# EAGLE board SparkFun_Pro_Micro_v13a (EAGLE 6.5.0)
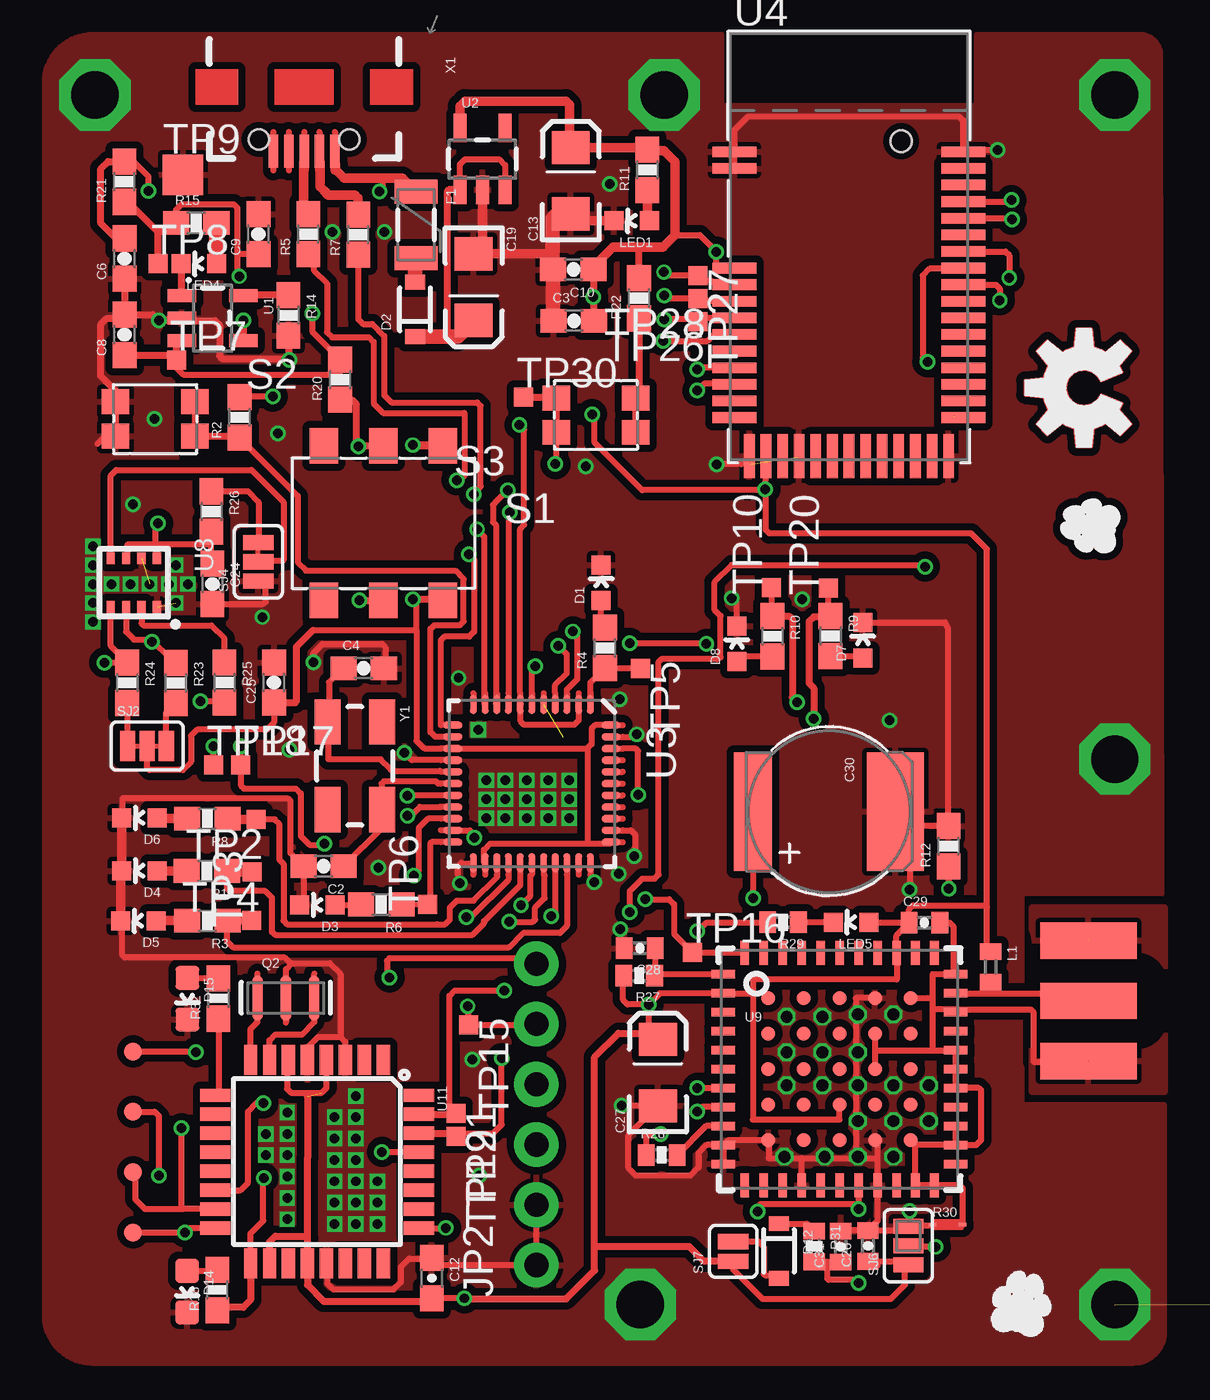
[diagram p5: board, top side]
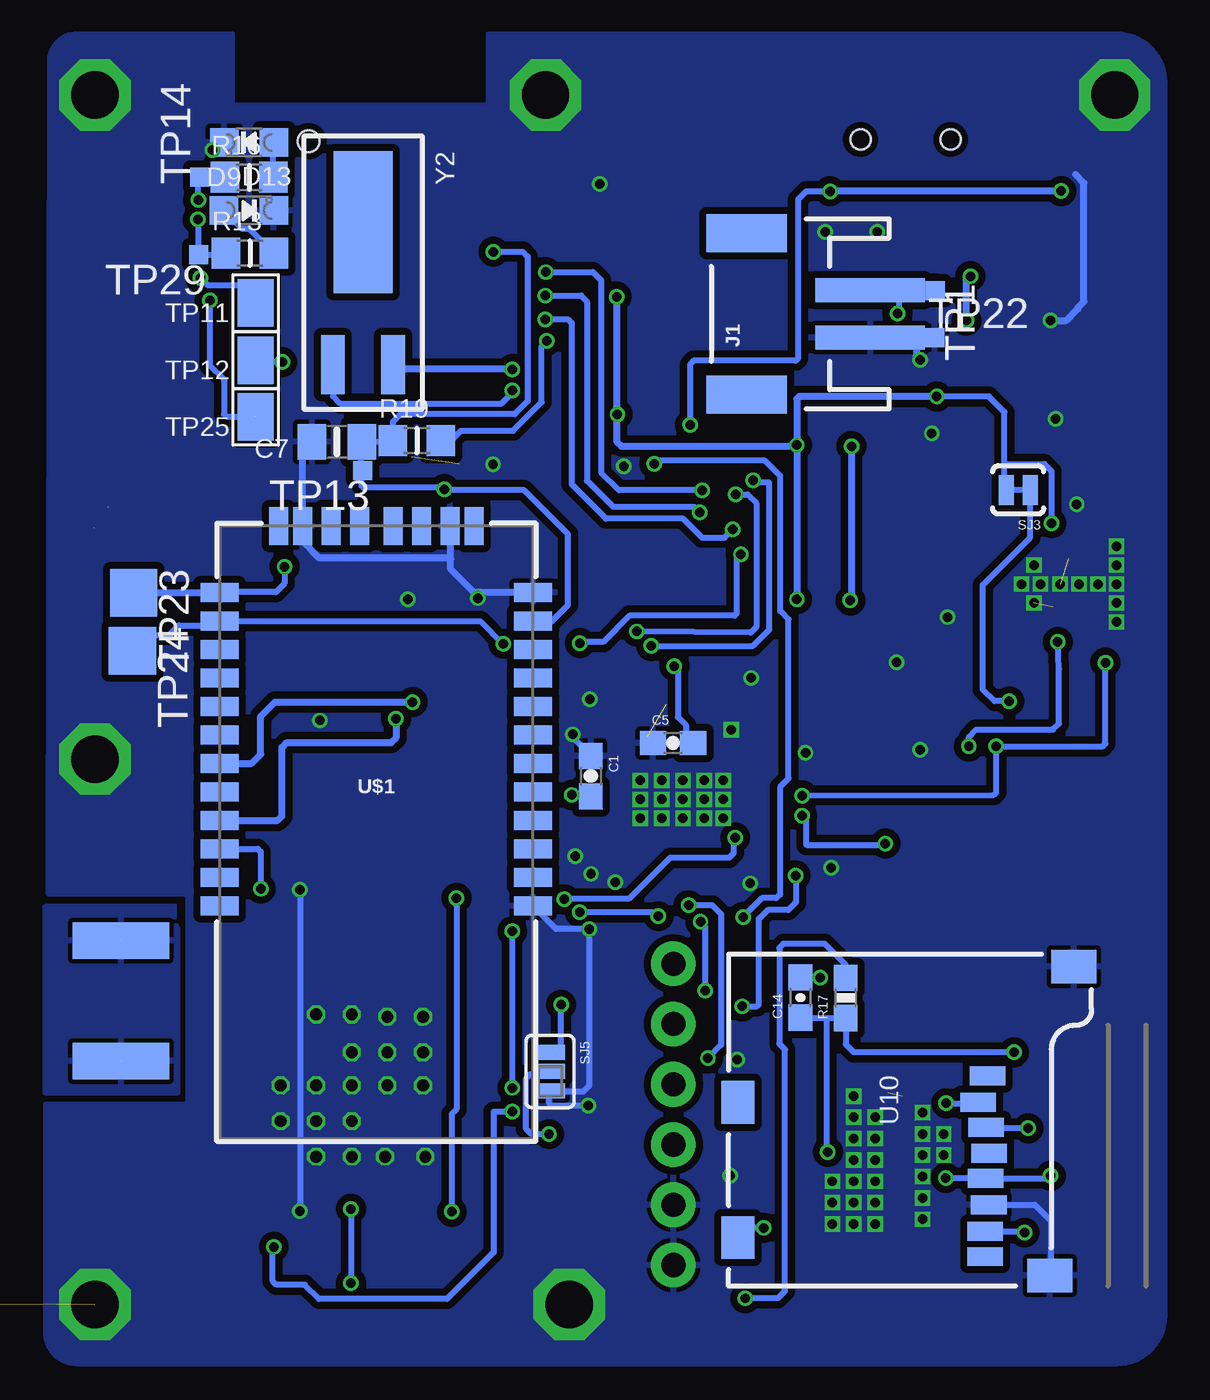
[diagram p6: board, bottom side, seen from below]

No outline drawn. Coordinates in mm, seen from the top.
Copper layers (1*16): Top 0.018mm / dielectric 1.55mm / Bottom 0.018mm
Design rules "eC_2Layer_PClass6_BaseCopperO18_eCDefault": minimum track width 0.15mm, minimum drill 0.35mm, track to track 0.15mm, track to pad 0.15mm, pad to pad 0.15mm, via to via 0.15mm, smd to smd 0mil, copper to edge 0.25mm, drill to drill 0.35mm, minimum pad ring 0.175mm, minimum via ring 0.125mm, stop-mask expansion 0mil, vias tented up to drill 0.45mm, thermal gap 0.2mm
Net classes: 0 default: width 0.203 mm

## Footprints (pad centres in the part's own frame; a part is rotated, then mirrored left to right if it is on the bottom)
0603-CAP = smd 1.1 x 1: 1 -0.85,0; 2 0.85,0
0805_10MGAP = smd 1.2 x 1.5: 1 -1.05,0; 2 1.05,0
EIA3216 = smd 1.4 x 1.6: A 1.4,0; C -1.4,0
0603-CAP@2 = smd 1.1 x 1: 1 -0.85,0; 2 0.85,0
0402-CAP = smd 0.7 x 0.9: 1 -0.65,0; 2 0.65,0
EN_J2 = smd 5 x 1.6: + 0,-3.2 | smd 5 x 2.4: - 0,2.8
LED-0603 = smd 0.8 x 0.8: A 0,-0.75; C 0,0.75
SOD-323 = smd 0.63 x 0.83: 1 -1.15,0; 2 1.15,0
CHIPLED_0805_NOOUTLINE = smd 1.2 x 1.2: A 0,-1.05; C 0,1.05
LED-0603' = smd 1 x 1: A 0,-0.877; C 0,0.877
PTC-1206 = smd 1 x 1.8: 1 -1.4,0; 2 1.4,0
JST-2-SMD = smd 1 x 4.6: 1 -1,-3.7; 2 1,-3.7 | smd 1.6 x 3.4: NC1 -3.4,1.5; NC2 3.4,1.5
1X06_NO_SILK = drill 1.016 pad 1.88: 1 0,0; 2 2.54,0; 3 5.08,0; 4 7.62,0; 5 10.16,0; 6 12.7,0
SMA-EDGE = smd 1.524 x 4.064: GND@0 0,0; GND@1 5.08,0; SIG 2.54,0 | smd 1.524 x 4.064 bottom: GND@2 0,0; GND@3 5.08,0
C0402 = smd 0.7 x 0.9: 1 -0.65,0; 2 0.65,0
RESONATOR-SMD = smd 0.45 x 1.905: 1 -1.2,0; 2 0,0; 3 1.2,0
0603-RES = smd 1.1 x 1: 1 -0.85,0; 2 0.85,0
_0805MP = smd 1.2 x 1.3: 1 -1.016,0; 2 1.016,0
0603-RES@2 = smd 1.1 x 1: 1 -0.85,0; 2 0.85,0
0402-RES = smd 0.7 x 0.9: 1 -0.65,0; 2 0.65,0
GND-JUMP = smd 0.305 x 0.152: 1 -0.635,0; 2 0.635,0
452403012014 = smd 1.2 x 1.5: 1 -2.5,3.25; 2 0,3.25; 3 2.5,3.25; 4 -2.5,-3.25; 5 0,-3.25; 6 2.5,-3.25
434153017835 = smd 1.15 x 1.05: 1 -1.675,0.725; 2 -1.675,-0.725; 3 1.675,-0.725; 4 1.675,0.725
PAD-JUMPER-3-3OF3_NC_BY_TRACE_YES_SILK_FULL_BOX = smd 0.635 x 1.27: 1 -0.813,0; 2 0,0; 3 0.813,0
PAD-JUMPER-2-NC_BY_TRACE_YES_SILK = smd 0.635 x 1.27: 1 -0.508,0; 2 0.508,0
PAD-JUMPER-3-2OF3_NC_BY_TRACE_YES_SILK_FULL_BOX = smd 0.635 x 1.27: 1 -0.813,0; 2 0,0; 3 0.813,0
SJ_3_PASTE2&3 = smd 0.635 x 1.27: 1 -0.813,0; 2 0,0; 3 0.813,0
SJ_2S = smd 0.635 x 1.27: 1 -0.412,0; 2 0.412,0
TP08SQ = smd 0.8 x 0.8: TP 0,0
TP17SQ = smd 1.7 x 1.7: TP 0,0
PAD-1.5X2.0 = smd 1.5 x 2: P$1 0,0
TP20SQ = smd 2 x 2: TP 0,0
PAD.03X.03 = smd 0.762 x 0.762: P$1 0,0
SOT23-5 = smd 0.55 x 1.2: 1 -0.95,-1.3; 2 0,-1.3; 3 0.95,-1.3; 4 0.95,1.3; 5 -0.95,1.3
QFN-44-NOPAD_1:1-OUTFAKES = smd 0.8 x 0.3: 1 -3.337,2.465; 2 -3.337,1.972; 3 -3.337,1.479; 4 -3.337,0.986; 5 -3.337,0.493; 6 -3.337,0; 7 -3.337,-0.493; 8 -3.337,-0.986; 9 -3.337,-1.479; 10 -3.337,-1.972; 11 -3.337,-2.465; 23 3.337,-2.465; 24 3.337,-1.972; 25 3.337,-1.479; 26 3.337,-0.986; 27 3.337,-0.493; 28 3.337,0; 29 3.337,0.493; 30 3.337,0.986; 31 3.337,1.479; 32 3.337,1.972; 33 3.337,2.465 | smd 0.3 x 0.8: 12 -2.465,-3.337; 13 -1.972,-3.337; 14 -1.479,-3.337; 15 -0.986,-3.337; 16 -0.493,-3.337; 17 0,-3.337; 18 0.493,-3.337; 19 0.986,-3.337; 20 1.479,-3.337; 21 1.972,-3.337; 22 2.465,-3.337; 34 2.465,3.337; 35 1.972,3.337; 36 1.479,3.337; 37 0.986,3.337; 38 0.493,3.337; 39 0,3.337; 40 -0.493,3.337; 41 -0.986,3.337; 42 -1.479,3.337; 43 -1.972,3.337; 44 -2.465,3.337
BLE_MODULE_RAYTAC_MDBT40 = smd 1.85 x 0.45: 1 -4.825,4; 2 -4.825,3.3; 3 -4.825,-0.9; 4 -4.825,-1.6; 5 -4.825,-2.3; 6 -4.825,-3; 7 -4.825,-3.7; 8 -4.825,-4.4; 9 -4.825,-5.1; 10 -4.825,-5.8; 11 -4.825,-6.5; 12 -4.825,-7.2; 26 4.825,-7.2; 27 4.825,-6.5; 28 4.825,-5.8; 29 4.825,-5.1; 30 4.825,-4.4; 31 4.825,-3.7; 32 4.825,-3; 33 4.825,-2.3; 34 4.825,-1.6; 35 4.825,-0.9; 36 4.825,-0.2; 37 4.825,0.5; 38 4.825,1.2; 39 4.825,1.9; 40 4.825,2.6; 41 4.825,3.3; 42 4.825,4 | smd 0.45 x 1.85: 13 -4.2,-8.825; 14 -3.5,-8.825; 15 -2.8,-8.825; 16 -2.1,-8.825; 17 -1.4,-8.825; 18 -0.7,-8.825; 19 0,-8.825; 20 0.7,-8.825; 21 1.4,-8.825; 22 2.1,-8.825; 23 2.8,-8.825; 24 3.5,-8.825; 25 4.2,-8.825 | hole 0.9: 2.2,4.45
BME280_LGA = smd 0.5 x 0.35: P$1 1.025,0.975; P$2 1.025,0.325; P$3 1.025,-0.325; P$4 1.025,-0.975; P$5 -1.025,-0.975; P$6 -1.025,-0.325; P$7 -1.025,0.325; P$8 -1.025,0.975
VENUS638FLPX = smd 1 x 0.36: 1 -4.9,4; 2 -4.9,3.2; 3 -4.9,2.4; 4 -4.9,1.6; 5 -4.9,0.8; 6 -4.9,0; 7 -4.9,-0.8; 8 -4.9,-1.6; 9 -4.9,-2.4; 10 -4.9,-3.2; 11 -4.9,-4; 23 4.9,-4; 24 4.9,-3.2; 25 4.9,-2.4; 26 4.9,-1.6; 27 4.9,-0.8; 28 4.9,0; 29 4.9,0.8; 30 4.9,1.6; 31 4.9,2.4; 32 4.9,3.2; 33 4.9,4 | smd 0.36 x 1: 12 -4,-4.9; 13 -3.2,-4.9; 14 -2.4,-4.9; 15 -1.6,-4.9; 16 -0.8,-4.9; 17 0,-4.9; 18 0.8,-4.9; 19 1.6,-4.9; 20 2.4,-4.9; 21 3.2,-4.9; 22 4,-4.9; 34 4,4.9; 35 3.2,4.9; 36 2.4,4.9; 37 1.6,4.9; 38 0.8,4.9; 39 0,4.9; 40 -0.8,4.9; 41 -1.6,4.9; 42 -2.4,4.9; 43 -3.2,4.9; 44 -4,4.9 | smd 0.6 x 0.6: 45 -3,3; 46 -3,1.5; 47 -3,0; 48 -3,-1.5; 49 -3,-3; 50 -1.5,3; 51 -1.5,1.5; 52 -1.5,0; 53 -1.5,-1.5; 54 -1.5,-3; 55 0,3; 56 0,1.5; 57 0,0; 58 0,-1.5; 59 0,-3; 60 1.5,3; 61 1.5,1.5; 62 1.5,0; 63 1.5,-1.5; 64 1.5,-3; 65 3,3; 66 3,1.5; 67 3,0; 68 3,-1.5; 69 3,-3
MICROSD_1:1 = smd 0.8 x 1.5: 1 5.096,10.919; 2 6.218,10.519; 3 7.274,10.853; 4 8.367,10.982; 5 9.421,10.828; 6 10.539,10.973; 7 11.648,10.819; 8 12.721,10.819 | smd 1.8 x 1.4: CD1 11.92,0.4; CD2 6.22,0.4 | smd 1.4 x 1.9: GND1 0.497,14.55; GND3 13.52,13.55
TQFP32-08 = smd 1.27 x 0.559: 1 -4.293,2.8; 2 -4.293,2; 3 -4.293,1.2; 4 -4.293,0.4; 5 -4.293,-0.4; 6 -4.293,-1.2; 7 -4.293,-2; 8 -4.293,-2.8; 17 4.293,-2.8; 18 4.293,-2; 19 4.293,-1.2; 20 4.293,-0.4; 21 4.293,0.4; 22 4.293,1.2; 23 4.293,2; 24 4.293,2.8 | smd 0.559 x 1.27: 9 -2.8,-4.293; 10 -2,-4.293; 11 -1.2,-4.293; 12 -0.4,-4.293; 13 0.4,-4.293; 14 1.2,-4.293; 15 2,-4.293; 16 2.8,-4.293; 25 2.8,4.293; 26 2,4.293; 27 1.2,4.293; 28 0.4,4.293; 29 -0.4,4.293; 30 -1.2,4.293; 31 -2,4.293; 32 -2.8,4.293
RN41 = smd 0.8 x 1.6: 1 -6.6,-6.6; 2 -5.4,-6.6; 3 -4.2,-6.6; 4 -3,-6.6; 5 -1.8,-6.6; 6 -0.6,-6.6; 7 0.6,-6.6; 8 1.8,-6.6; 9 3,-6.6; 10 4.2,-6.6; 11 5.4,-6.6; 12 6.6,-6.6; 13 6.6,6.6; 14 5.4,6.6; 15 4.2,6.6; 16 3,6.6; 17 1.8,6.6; 18 0.6,6.6; 19 -0.6,6.6; 20 -1.8,6.6; 21 -3,6.6; 22 -4.2,6.6; 23 -5.4,6.6; 24 -6.6,6.6 | smd 1.6 x 0.8: 28 9.4,3.1; 29 9.4,-3.1; 30 9.4,4.122; 31 9.4,1.9; 32 9.4,0.7; 33 9.4,-0.7; 34 9.4,-1.9; 35 9.4,-4.122
USB-AB-MICRO-SMD-V03-IN&OUT = smd 1.4 x 0.4: D+1 2.7,0; D-1 2.7,0.65; GND1 2.7,-1.3; ID1 2.7,-0.65; VBUS1 2.7,1.3 | hole 0.85: 2.2,1.9; 2.2,-1.9
CRYSTAL-SMD-5X3 = smd 1.9 x 1.1: 1 -1.85,-1.15; 2 1.85,-1.15; 3 1.85,1.15; 4 -1.85,1.15
CRYSTAL_CYL_2X6MM_SMT = smd 2.5 x 1: 1 2.125,1.27; 2 2.125,-1.27 | smd 6 x 2.5: CYLINDER -3.875,0

## Placement (x,y rotation side)
C1  0.1uF  [0603-CAP]  27.03,22.84 270 bottom
C2  22pF  [0603-CAP]  14.58,19.05 180 top
C3  0.1uF  [0603-CAP]  25.13,42.04 0 top
C4  22pF  [0603-CAP]  16.27,27.39 0 top
C5  1uF  [0603-CAP]  23.56,24.24 0 bottom
C6  1uF  [0603-CAP]  6.19,44.66 90 top
C7  1uF  [0805_10MGAP]  37.73,36.94 180 bottom
C8  4.7uF  [0603-CAP]  6.19,41.45 90 top
C9  4.7uF  [0603-CAP]  11.84,45.69 90 top
C10  1uF  [0603-CAP]  25.11,44.2 180 top
C12  0.1uF  [0603-CAP]  19.14,1.68 270 top
C13  10uF  [EIA3216]  25,47.94 90 top
C14  0.1uF  [0603-CAP]  18.19,13.51 90 bottom
C19  10uF  [EIA3216]  20.91,43.46 270 top
C24  0.1uF  [0603-CAP@2]  9.89,30.95 270 top
C25  0.1uF  [0603-CAP@2]  12.49,26.79 90 top
C26  0.1uF  [0402-CAP]  37.53,3.04 90 top
C27  10uF  [EIA3216]  28.67,10.34 90 top
C28  1uF  [0402-CAP]  27.91,15.59 180 top
C29  22pF  [0402-CAP]  39.91,16.66 0 top
C30  DNP  [EN_J2]  35.89,21.35 270 top
C31  0.1uF  [0402-CAP]  36.38,3.01 90 top
D1  Yellow  [LED-0603]  26.28,31 0 top
D2  [SOD-323]  18.44,42.52 90 top
D3  Green  [LED-0603]  14.32,17.41 90 top
D4  Yellow  [LED-0603]  6.82,18.85 90 top
D5  Yellow  [LED-0603]  6.77,16.74 90 top
D6  Yellow  [LED-0603]  6.82,21.08 90 top
D7  Yellow  [LED-0603]  37.31,28.57 0 top
D8  Yellow  [LED-0603]  32,28.42 0 top
D9  RED  [CHIPLED_0805_NOOUTLINE]  41.44,46.69 270 bottom
D12  BAS16  [SOD-323]  33.78,2.83 270 top
D13  BLUE  [CHIPLED_0805_NOOUTLINE]  41.43,49.56 90 bottom
D14  GREEN  [LED-0603']  8.83,1.11 180 top
D15  BLUE  [LED-0603']  8.84,13.46 180 top
F1  500mA  [PTC-1206]  18.48,46.08 270 top
J1  [JST-2-SMD]  18.95,42.33 90 bottom
JP2  [1X06_NO_SILK]  23.55,2.23 90 top
JP10  SMA_EDGE  [SMA-EDGE]  46.83,10.83 90 top
L1  33nH  [C0402]  42.7,14.8 270 top
LED1  Red  [LED-0603]  27.57,46.25 90 top
LED4  Red  [LED-0603]  9.32,44.44 90 top
LED5  Red  [LED-0603]  36.82,16.68 90 top
Q2  16MHZ  [RESONATOR-SMD]  12.99,13.49 0 top
R1  330  [0603-RES]  9.66,18.85 180 top
R2  10K  [0603-RES]  11.04,37.97 90 top
R3  330  [0603-RES]  9.68,16.75 180 top
R4  330  [0603-RES]  26.44,28.25 90 top
R5  22  [0603-RES]  13.94,45.69 90 top
R6  330  [0603-RES]  17.01,17.43 180 top
R7  22  [0603-RES]  16.04,45.67 90 top
R8  330  [0603-RES]  9.68,21.05 180 top
R9  330  [0603-RES]  35.95,28.75 270 top
R10  330  [0603-RES]  33.5,28.74 270 top
R11  1K  [0603-RES]  28.23,48.4 90 top
R12  10K  [0603-RES]  40.93,19.89 90 top
R13  2K  [_0805MP]  41.4,44.89 0 bottom
R14  2K  [0603-RES]  13.1,42.27 270 top
R15  330  [0603-RES]  9.21,46.16 0 top
R16  2K  [_0805MP]  41.43,48.09 0 bottom
R17  10K  [0603-RES]  16.28,13.49 90 bottom
R18  330  [0603-RES]  10.1,1.18 90 top
R19  100K  [_0805MP]  34.36,36.99 0 bottom
R20  1  [0603-RES]  15.28,39.56 90 top
R21  1  [0603-RES]  6.18,47.9 90 top
R22  10K  [0603-RES]  27.88,42.99 90 top
R23  4.7K  [0603-RES@2]  8.35,26.77 270 top
R24  4.7K  [0603-RES@2]  6.3,26.78 270 top
R25  4.7K  [0603-RES@2]  10.4,26.79 270 top
R26  4.7K  [0603-RES@2]  9.85,34 270 top
R27  33k  [0402-RES]  27.88,14.43 180 top
R28  10k  [0402-RES]  28.84,6.87 0 top
R29  330  [0402-RES]  33.95,16.68 180 top
R30  0  [GND-JUMP]  40.89,3.94 0 top
R31  330  [0402-RES]  35.26,3.02 270 top
R32  1K  [0603-RES]  10.15,13.47 90 top
S1  [452403012014]  17.1,33.51 0 top
S2  [434153017835]  7.48,37.9 0 top
S3  [434153017835]  26.06,38.06 180 top
SJ2  EN I2C PULL  [PAD-JUMPER-3-3OF3_NC_BY_TRACE_YES_SILK_FULL_BOX]  7.14,24.11 0 top
SJ3  EN I2C MODE  [PAD-JUMPER-2-NC_BY_TRACE_YES_SILK]  9.01,34.91 180 bottom
SJ4  EN ADR PULLUP  [PAD-JUMPER-3-2OF3_NC_BY_TRACE_YES_SILK_FULL_BOX]  11.83,31.88 90 top
SJ5  BTS  [SJ_3_PASTE2&3]  28.75,10.39 270 bottom
SJ6  PSE  [SJ_3_PASTE2&3]  39.23,3.05 90 top
SJ7  BAT  [SJ_2S]  31.85,2.81 90 top
TP1  TPTP08SQ  [TP08SQ]  12.51,43.31 270 bottom
TP2  TPTP08SQ  [TP08SQ]  11.73,21.02 180 top
TP3  TPTP08SQ  [TP08SQ]  11.55,16.76 90 top
TP4  TPTP08SQ  [TP08SQ]  11.57,18.8 180 top
TP5  TPTP08SQ  [TP08SQ]  27.93,27.39 270 top
TP6  TPTP08SQ  [TP08SQ]  18.97,17.43 90 top
TP7  TPTP08SQ  [TP08SQ]  8.39,40.39 0 top
TP8  TPTP08SQ  [TP08SQ]  7.61,44.44 0 top
TP9  TPTP17SQ  [TP17SQ]  8.65,48.19 0 top
TP10  TPTP08SQ  [TP08SQ]  33.47,30.8 90 top
TP11  SWCLK  [PAD-1.5X2.0]  41.16,42.79 180 bottom
TP12  SWDIO  [PAD-1.5X2.0]  41.16,40.38 180 bottom
TP13  TPTP08SQ  [TP08SQ]  36.64,35.73 180 bottom
TP14  TPTP08SQ  [TP08SQ]  43.51,48.1 90 bottom
TP15  TPTP08SQ  [TP08SQ]  20.7,12.35 270 top
TP16  TPTP08SQ  [TP08SQ]  30.14,15.42 0 top
TP17  TPTP08SQ  [TP08SQ]  11.09,23.32 0 top
TP18  TPTP08SQ  [TP08SQ]  9.94,23.32 0 top
TP19  TPTP08SQ  [TP08SQ]  20.16,7.65 270 top
TP20  TPTP08SQ  [TP08SQ]  35.86,30.77 90 top
TP21  TPTP08SQ  [TP08SQ]  20.17,8.63 270 top
TP22  TPTP08SQ  [TP08SQ]  12.52,41.33 0 bottom
TP23  TPTP20SQ  [TP20SQ]  46.3,30.58 270 bottom
TP24  TPTP20SQ  [TP20SQ]  46.35,28.13 270 bottom
TP25  FCTRST  [PAD-1.5X2.0]  41.16,37.99 180 bottom
TP26  TPTP08SQ  [TP08SQ]  30.36,42.01 180 top
TP27  TPTP08SQ  [TP08SQ]  30.37,43.95 270 top
TP28  TPTP08SQ  [TP08SQ]  30.37,42.97 180 top
TP29  TPTP08SQ  [TP08SQ]  43.56,44.82 180 bottom
TP30  TPTP08SQ  [TP08SQ]  23.01,38.83 0 top
TP32  TEST-POINT3  [PAD.03X.03]  6.55,3.61 270 top
TP33  TEST-POINT3  [PAD.03X.03]  6.55,6.15 0 top
TP34  TEST-POINT3  [PAD.03X.03]  6.55,8.69 270 top
TP35  TEST-POINT3  [PAD.03X.03]  6.55,11.23 270 top
U1  MCP73831  [SOT23-5]  9.9,42.15 270 top
U2  MIC5219  [SOT23-5]  21.28,48.86 0 top
U3  ATMEGA32U4  [QFN-44-NOPAD_1:1-OUTFAKES]  23.36,22.53 270 top
U4  32KB NRF51822  [BLE_MODULE_RAYTAC_MDBT40]  36.73,45.16 0 top
U8  BME280  [BME280_LGA]  6.58,31 270 top
U9  VENUS638FLPX-L  [VENUS638FLPX]  36.33,10.49 0 top
U10  microSD Socket  [MICROSD_1:1]  21.22,15.31 270 bottom
U11  ATMEGA328P_TQFP  [TQFP32-08]  14.3,6.59 270 top
U$1  BLUETOOTH-RN-41"  [RN41]  36.07,23.98 90 bottom
U$3  [OSHW-LOGO-M_COPPER]  46.63,39.21 90 top
U$4  [OSHW-LOGO-M]  46.63,39.21 90 top
X1  [USB-AB-MICRO-SMD-V03-IN&OUT]  13.76,51.89 270 top
Y1  16MHz  [CRYSTAL-SMD-5X3]  15.89,23.28 270 top
Y2  32.768kHz (535-9166-2-ND)  [CRYSTAL_CYL_2X6MM_SMT]  36.63,42.32 270 bottom

## Tracks (layer width: path | path; a pad name or v marks a point on that pad's centre or on a via)
!CS
  Top 0.254: 6.84,29.9 6.86,29.87 U8.P$2 6.9,29.28 6.99,29.2 9.84,29.2 10.4,28.64 R25.1
ANT
  Top 0.254: 46.54,13.66 JP10.SIG 46.51,13.69 42.69,13.69 | U9.32 42.69,13.69 | L1.2 42.7,13.7 42.69,13.69
AREF  (via drill 0.4 pad 0.25)
  Top 0.254: v27.84,22.05 27.84,23.9 27.74,24 27.19,24 27.19,24.01
  Bottom 0.254: C1.2 27.73,21.99 27.79,22.05 v27.84,22.05
BOOT_SEL
  Top 0.254: U9.9 30.71,8.09 R28.2
CD  (via drill 0.4 pad 0.25)
  Top 0.254: U11.25 19.73,3.79 v19.74,3.8
  Bottom 0.254: v19.74,3.8 20.41,3.8 U10.CD1
CONNECTED  (via drill 0.4 pad 0.25)
  Top 0.254: U4.39 43.51,47.06 v43.58,47.13
  Bottom 0.254: R16.1 42.45,48.1 TP14.TP 43.54,48.07 | 43.75,47.86 43.54,48.07 | 43.54,48.07 43.54,47.95 43.6,47.89 43.6,47.15 v43.58,47.13
CS  (via drill 0.4 pad 0.25)
  Top 0.254: U11.14 11.08,5.39 11.39,5.7 11.39,8.7 11.74,9.05 v12.04,9.05
  Bottom 0.254: v12.04,9.05 10.74,9.05 U10.2
CS_3V  (via drill 0.4 pad 0.25)
  Top 0.254: 31.86,41.5 U4.7 31.88,41.48 31.05,41.48 30.76,41.19 v28.89,41.19
  Bottom 0.254: R19.2 33.28,36.99 | 33.28,36.99 33.24,36.95 | 33.28,36.99 32.91,36.99 32.5,37.4 30.3,37.4 29.1,38.6 29.1,40.98 v28.89,41.19
D1  (via drill 0.4)
  Top 0.254: 35.79,30.84 TP20.TP 35.86,29.62 R9.1
  Top 0.305: R9.1 35.95,29.57 35.94,29.56 35.24,29.56 35.04,29.36 35.04,26.76 35.24,26.56 v35.24,25.26
  Bottom 0.305: U$1.21 40.22,20.98 40.04,21.16 40.04,24.06 39.84,24.26 35.44,24.26 35.24,24.46 v35.24,25.26
D2  (via drill 0.4)
  Top 0.254: TP10.TP 33.47,29.62 R10.1
  Top 0.305: R10.1 34.21,29.59 34.34,29.46 34.34,26.16 v34.54,25.96
  Bottom 0.305: U$1.19 41.32,23.38 40.94,23.76 40.94,25.36 40.34,25.96 v34.54,25.96
D4
  Top 0.254: 11.94,20.92 11.84,21.02 TP2.TP 12.52,21.02 12.72,20.82 12.72,19.32 12.89,19.15 12.89,16.75 13.04,16.6 19.36,16.6 19.7,16.6 19.9,16.8 19.9,17.3 20.2,17.6 20.9,17.6 21.88,18.58 21.88,18.7
  Top 0.406: TP2.TP 10.56,21.02 R8.1
D5
  Top 0.254: 24.84,18.7 24.84,16.53 24.54,16.23 22.99,16.23 22.39,15.63 10.76,15.63 10.52,15.87 10.52,16.74 R3.1
  Top 0.406: TP3.TP 10.56,16.78 R3.1
D6
  Top 0.254: R1.1 10.52,18.84 10.52,18.09 10.61,18 12.12,18 12.41,17.71 12.41,16.27 12.53,16.15 20.85,16.15 21.34,16.64 21.34,16.72 22.86,18.24 22.86,18.7
  Top 0.406: TP4.TP 10.55,18.81 R1.1
D14
  Top 0.254: U3.1 25.82,26.34 25.84,26.35 | 25.82,26.34 25.82,26.79 R4.1 27.87,27.4 TP5.TP
D+  (via drill 0.4 pad 0.25)
  Top 0.254: v20.19,35.32 20.34,35.32 20.54,35.52 20.54,38.12 20.51,38.15 17.09,38.15 16.69,38.55 16.69,41.15 16.49,41.35 16.48,41.34 14.93,41.34 14.72,41.55 14.72,43.62 14.19,44.15 14.19,44.59 R5.1 | 24.34,26.34 24.34,26.69 24.83,27.18 24.83,27.98 v24.48,28.33
  Bottom 0.254: v20.19,35.32 20.08,35.21 19.5,35.21 19.5,29.01 20.18,28.33 v24.48,28.33
D-  (via drill 0.4 pad 0.25)
  Top 0.254: R7.1 16.04,42.1 16.24,41.9 16.64,41.9 17.14,41.4 17.14,38.9 17.44,38.6 21.05,38.6 21.2,38.45 21.2,35.05 20.92,34.77 v20.92,34.72 | U3.3 24.84,26.49 25.28,26.93 25.28,28.75 v25.09,28.94
  Bottom 0.254: v20.92,34.72 20.42,34.72 20.05,34.35 20.05,29.12 20.28,28.89 v25.09,28.94
DTR  (via drill 0.4 pad 0.25)
  Top 0.254: JP2.6 23.31,15.17 17.36,15.17 17.25,15.06 17.25,14.46 v17.36,14.35
  Bottom 0.254: 18.21,14.38 C14.2 18.18,14.35 v17.36,14.35
FACTORYRST  (via drill 0.4 pad 0.25)  (1 unrouted)
  Top 0.254: U4.34 42.93,43.56 43.09,43.4 v43.09,42.9
  Bottom 0.254: TP25.P$1 42.39,38 42.49,38.1 42.49,39.55 43.09,40.15 v43.09,42.9
GND  (via drill 0.4, 0.4 pad 0.25, 0.4 pad 0.3, 0.5, 2)  (5 unrouted)
  Top 0.254: U4.13 32.59,36.27 32.59,36 32.54,35.95 32.54,36 | U4.25 40.93,36.31 40.94,36.3 | U4.2 U4.1 31.91,50.08 32.48,50.65 41.38,50.65 41.55,50.47 U4.42 42.25,49.16 42.34,49.25 v42.99,49.25 | 32.54,37.1 32.54,36.34 U4.13 | 8.84,12.55 D15.C 8.66,12.76 | U11.5 13.9,11.41 14.34,11.85 15.29,11.85 | 15.29,11.85 15.49,11.65 15.49,10.89 U11.3 | 13.24,14.95 14.84,14.95 15.29,14.5 15.29,11.85 | 12.99,12.45 12.99,12.47 12.99,14.7 13.24,14.95 | 13.24,14.95 13.19,14.95 12.94,15.2 6.22,15.2 6.21,15.19 6.07,15.33 6.07,16.69 | 14.73,2.3 U11.21 14.74,2.26 | 14.73,2.3 14.74,2.3 | 14.73,2.3 14.73,1.45 14.99,1.2 17.54,1.2 17.84,1.5 17.84,2.15 18.19,2.5 19.11,2.5 C12.1 19.44,2.23 JP2.1 JP2.2 | U9.10 U9.11 | U9.64 37.93,7.39 37.93,6.73 | U9.10 31.63,7.49 U9.49 33.35,7.49 33.35,6.73 34.74,6.73 | C27.C 29,8.94 29.09,8.85 | C26.2 36.41,3.69 C31.2 36.5,3.66 36.59,3.75 | C27.C 27.44,7.71 27.44,6.3 27.74,6 30.04,6 30.39,6.35 30.39,6.95 30.73,7.29 U9.10 | 29.09,8.85 28.74,8.85 | 29.09,8.85 29.09,8.8 | 29.09,8.8 28.84,8.55 | 29.09,8.8 28.59,8.8 | C26.2 39.05,3.69 SJ6.3 39.26,3.9 | C26.2 37.93,4.09 U9.19 37.93,6.73 | S2.2 5.36,37.17 5.04,36.85 | C25.2 12.45,27.64 12.14,27.95 | SJ4.1 12.14,30.76 12.14,30.2 12.04,30.1 C24.2 | D6.C 6.09,21.1 6.09,21.9 13.09,21.9 13.19,21.8 13.19,19.59 C2.2 13.73,17.57 D3.C | U3.43 26.64,24.5 | 37.83,13.44 U9.60 37.02,13.49 37.02,6.73 | 27.19,24.5 27.69,24.5 v27.79,24.6 | C27.C v27.15,8.94 v27.14,8.95 | v27.09,16.4 27.09,15.76 C28.2 | D8.C 32,30.14 v31.79,30.35 | 34.59,36.29 U4.16 | 39.3,20.74 R12.2 40.92,20.75 40.92,29.05 40.79,29.32 D7.C | 39.3,20.74 C30.- | 39.3,20.74 v39.3,18.06 v39.29,18.05 | v39.29,4.5 39.29,3.92 39.26,3.9
  Top 0.254: 34.74,6.73 37.02,6.73 | 37.02,6.73 37.93,6.73 | U9.15 34.74,6.73 | U4.13 32.18,35.99 v31.15,35.99 | 39.26,3.9 40.21,3.9 R30.1 | 19.53,23.51 18.29,23.51 v17.98,23.83 | 20.89,18.7 20.89,19.01 20.76,19.14 20.44,19.14 20.39,19.19 20.24,19.04 20.24,18.71 20.23,18.72 | v14.14,27.65 14.14,28.02 14.53,28.41 17.03,28.41 17.18,28.26 17.18,27.46 C4.2 | 27.19,20.55 27.54,20.55 27.71,20.38 27.71,19.49 v27.68,19.46
  Top 0.305: R14.2 13.1,40.51 | 13.1,40.51 12.99,40.4 | 8.7,42.05 U1.2 | 8.7,42.05 v7.64,42.05 7.39,42.3 C8.2 | S2.2 S2.1 5.8,39.08 5.19,39.7 5.19,41.9 5.44,42.15 6.04,42.15 C8.2 | 13.1,40.51 13.14,40.47 v13.14,40.4 13.09,40.45 10.29,40.45 10.19,40.55 10.19,41.85 9.99,42.05 8.7,42.05 | C6.1 C8.2
  Top 0.406: 6.07,16.69 D5.C 6.02,18.8 D4.C D6.C | U2.2 21.28,45.23 C19.C 24.08,44.86 24.24,44.7 | LED1.C 25.29,46.25 C13.C
  Top 0.61: C3.1 24.26,42.06 C10.2 24.24,44.22 24.24,44.7 24.24,46.35 24.44,46.55 25.04,46.55 25.03,46.54 C13.C
  Bottom 0.254: 42.49,49.55 D13.C 42.79,49.25 v42.99,49.25 | U10.GND3 7.64,1.82 7.64,4.1 8.31,4.77 U10.6 10.27,4.77 10.29,4.75 10.29,4.65 | 6.98,14.5 U10.GND1 | 24.67,24.5 C5.1 24.49,24.16 | C1.1 27.39,24.1 27.79,24.5 v27.79,24.6 | v27.14,8.95 28.69,8.95 28.79,9.05 28.79,9.54 SJ5.3 28.75,9.56 28.74,9.55 27.34,9.55 27.09,9.8 v27.09,16.4 28.49,16.4 U$1.1 | 32.89,33.3 U$1.29 | v39.29,18.05 v39.29,4.5
  Bottom 0.305: v7.64,42.05 6.99,42.05 6.49,42.55 6.49,42.6 6.24,42.85 6.24,47.85 6.59,48.2 | 13.31,41.33 13.31,40.57 v13.14,40.4 | U$1.12 31.95,30.58 | 31.95,30.58 32.93,31.56 32.93,32 | v31.79,30.35 31.79,30.41 31.95,30.58 | 32.93,32 32.93,33.35 U$1.29 | 32.93,32 32.97,32.04 38.48,32.04 39.18,32.74 39.18,33.36 U$1.28 39.17,36.55 C7.2
  Bottom 0.813: 13.31,41.33 13.34,41.3 13.34,41.35 | J1.1 13.31,41.33 | 13.31,41.33 TP22.TP
  other vias: 20.27,26.98 38.45,25.19 14.95,45.79 17.15,45.79 13.14,23.95 16.89,18.99 20.31,18.32 4.93,51.56 28.93,51.56 47.93,51.56 47.93,0.56 27.93,0.56 11.99,29.55 27.07,26.08 24.94,21.86 24.94,22.66 22.24,22.66 23.14,22.66 24.04,22.66 13.04,6.86 13.04,7.76 13.04,8.66 13.04,5.06 13.04,5.96 15.04,5.76 15.04,6.66 15.04,7.56 15.94,5.76 15.94,6.66 15.94,7.56 15.04,8.46 15.94,8.46 16.84,3.96 15.94,3.96 15.04,3.96 16.84,4.86 15.94,4.86 15.04,4.86 34.75,30.29 22.24,21.86 23.14,21.86 24.04,21.86 34.1,12.7 34.1,11.2 35.6,12.7 37.1,12.8 35.6,11.2 37.1,11.2 34.1,9.8 35.6,9.8 37.1,9.8 38.6,9.8 38.6,12.8 38.6,8.3 37.1,8.3 40.1,9.8 40.1,8.3 34,6.8 35.7,6.8 37.1,6.8 38.6,6.8 21.1,24.79 25.99,18.37 27.02,18.72 21.44,22.66 21.44,21.86 24.94,21.06 22.24,21.06 23.14,21.06 24.04,21.06 21.44,21.06 25.64,35.9 26.65,47.8 21.15,6 20.85,10.9 7.44,37.9 12.65,37.29 6.44,30.94 5.64,30.94 7.24,30.94 4.86,30.94 4.86,30.14 4.86,31.74 4.86,32.54 4.86,29.34 6.54,34.3 8.34,31.74 8.34,30.14 8.06,30.94 8.86,30.94 16.84,5.76 13.04,4.16 12.14,7.76 12.14,6.86 15.94,9.36 47.93,23.56
  pour Top (isolate 0.305): 50,8.99 50,-0.6 arc-90 48.7,-1.9 4.84,-1.9 arc-90 2.84,0.1 2.84,52.1 arc-90 4.84,54.1 31.34,54.1 31.34,51.1 42.14,51.1 42.14,54.1 48.97,54.1 arc-90 49.84,53.24 49.9,17.89 44,17.89 44,8.99
  pour Bottom (isolate 0.305): 50,8.99 50,-0.6 arc-90 48.7,-1.9 4.84,-1.9 arc-90 2.84,0.1 2.84,52.1 arc-90 4.84,54.1 31.34,54.1 31.34,51.1 42.14,51.1 42.14,54.1 48.7,54.1 arc-90 49.84,52.97 49.9,17.89 44,17.89 44,8.99
MISO  (via drill 0.4 pad 0.25)
  Top 0.254: U11.16 8.93,3.79 v8.74,3.6 8.73,3.61 TP32.P$1
  Bottom 0.254: U10.7 8.8,3.66 v8.74,3.6
MISO_BLE  (via drill 0.4 pad 0.25)
  Top 0.254: 28.96,43.12 v28.94,43.1 28.94,42.97 TP28.TP | 22.39,25.88 U3.8 22.38,33.63 22.43,33.68 v22.43,33.96 | TP28.TP 30.49,42.97 30.49,42.95 30.5,42.95 30.5,42.93 | U4.5 30.37,42.86 TP28.TP
  Bottom 0.254: v28.94,43.1 27.44,43.1 27.19,42.85 27.19,35.3 26.09,34.2 22.67,34.2 v22.43,33.96
MODE  (via drill 0.4 pad 0.25)
  Top 0.254: U4.38 43.55,46.36 v43.6,46.31
  Bottom 0.254: 42.79,45.26 R13.1 42.48,44.82 TP29.TP 43.56,46.28 v43.6,46.31 43.59,46.31 43.58,46.3
MOSI  (via drill 0.4 pad 0.25)
  Top 0.254: TP33.P$1 6.64,6.25 6.64,5 7.04,4.6 8.64,4.6 | 9.94,4.6 U11.15 9.95,4.59 9.94,4.6 | 9.94,4.6 8.64,4.6 | 8.64,4.6 8.59,4.65 v8.59,8
  Bottom 0.254: v8.59,8 10.33,8 U10.3
MOSI_BLE  (via drill 0.4 pad 0.25)
  Top 0.254: v28.94,42.1 28.96,42.12 30.36,42.12 TP26.TP 30.41,42.17 31.27,42.17 31.27,42.15 U4.6 | v21.05,33.24 21.35,32.94 21.35,25.9 U3.10
  Bottom 0.254: v28.94,42.1 27.99,42.1 27.84,41.95 27.84,35.15 26.39,33.7 23.14,33.7 22.34,32.9 21.39,32.9 v21.05,33.24
N$1
  Top 0.254: 19.53,23.02 19.48,23.07 17.46,23.07 17.4,23.13 17.4,23.14 16.99,23.55 14.79,23.55 14.79,25.08 Y1.1 14.8,25.18 14.8,26.8 15.39,27.39 C4.1
N$2
  Top 0.254: Y1.3 17.04,20.66 C2.1 | 16.94,21.53 Y1.3 | 19.52,22.53 19.53,22.53 19.41,22.53 19.32,22.62 17.12,22.62 17.02,22.52 17.02,21.45 Y1.3
N$3
  Top 0.61: D2.2 18.44,44.64 F1.2
N$4  (via drill 0.4 pad 0.25)
  Top 0.254: U3.6 23.36,27.45 v23.5,27.48
  Bottom 0.254: v23.5,27.48 23.35,27.44 23.35,25.33 23.02,25 23.02,24.55 C5.2
N$5
  Top 0.254: R4.2 26.27,29.27 26.27,30.24 D1.A
N$6
  Top 0.406: 14.41,48.38 14.41,48.72 14.44,48.75 14.44,47.68 14.59,47.53 14.59,47.52 14.77,47.34 15.9,47.34 16.03,47.21 R7.2 16.04,46.55
N$7
  Top 0.406: R1.2 D4.A
N$8
  Top 0.406: 13.76,48.38 13.76,48.68 13.74,48.7 13.74,46.74 R5.2
N$9
  Top 0.406: R3.2 D5.A
N$10
  Top 0.406: R8.2 7.6,21.05 D6.A
N$11
  Top 0.254: D3.A 16.37,17.41 R6.2
N$12  (via drill 0.4 pad 0.25)
  Top 0.254: v40.94,18.1 R12.1
  Bottom 0.254: U$1.22 41.07,19.78 40.94,19.65 v40.94,18.1
N$13
  Top 0.254: 35.89,27.95 R9.2 37.23,27.9 D7.A
N$14
  Top 0.254: R10.2 32.22,27.89 D8.A
N$15
  Bottom 0.254: 42.44,46.75 D9.A 41.7,45.91 41.41,45.91 40.39,44.89 R13.2
N$16
  Bottom 0.254: R16.2 40.41,49.52 D13.A
N$17  (via drill 0.4 pad 0.25)
  Top 0.254: U4.9 30.4,40.06 v30.34,40
  Bottom 0.305: v30.34,40 35.16,40 Y2.1
N$18
  Top 0.305: R14.1 11.22,43.12 U1.5
N$19
  Top 0.61: R15.2 10.06,44.45 LED4.A
N$20
  Top 0.305: LED4.C 8.57,43.13 U1.1
N$21  (via drill 0.4 pad 0.25)
  Top 0.254: 31.79,39.25 U4.10 31.89,39.34 31.79,39.34 31.74,39.4 30.64,39.4 v30.34,39.1
  Bottom 0.254: Y2.2 37.9,38.86 37.59,38.55 30.79,38.55 30.34,39 v30.34,39.1
N$22
  Top 0.254: D14.A 10.05,1.99 R18.2
N$28
  Top 0.254: SJ2.3 7.94,24.15 7.94,25.51 R23.2
N$29
  Top 0.254: R24.2 6.31,24.13 SJ2.1
N$30  (via drill 0.4 pad 0.25)
  Top 0.254: v9.39,26 10.34,26 R25.2
  Bottom 0.254: 8.39,34.8 SJ3.1 8.5,32.9 10.5,30.9 10.5,26.5 10,26 v9.39,26
N$31
  Top 0.254: R26.1 11.39,34.85 11.84,34.4 11.84,32.7 SJ4.3
N$32
  Top 0.254: U11.8 11.5,12.18 11.79,12.47
N$33
  Top 0.254: U11.7 12.3,11.71 12.54,11.95 13.66,11.95 14.19,12.47
N$34
  Top 0.254: LED5.C R29.1
N$35  (via drill 0.4 pad 0.25)
  Top 0.254: R28.1 28.19,7.7 28.24,7.75 v28.79,7.75
  Bottom 0.254: 28.84,10.3 SJ5.2 28.85,10.29 29.56,10.29 29.75,10.11 29.75,7.97 29.52,7.75 v28.79,7.75
N$36
  Top 0.254: SJ7.2 32.91,3.22 33.14,3 33.14,1.85 33.19,1.8 33.66,1.8 D12.2
N$37
  Top 0.254: D12.1 34.95,3.98 R31.1
N$38
  Top 0.406: R11.1 28.23,46.34 LED1.A
N$39
  Top 0.254: D15.A 10.13,14.34 R32.2
N$40
  Top 0.254: R32.1 10.15,9.53 U11.9
N$70  (via drill 0.4 pad 0.25)
  Top 0.305: S1.2 v16.05,36.76 v16.04,36.75 15.94,36.85 15.94,38.55 15.78,38.71 R20.1 | v16.09,30.25 17.09,30.25 S1.5
  Top 0.406: 16.83,37.03 S1.2
  Bottom 0.305: v16.04,36.75 16.04,30.3 v16.09,30.25
NAV  (via drill 0.4 pad 0.25)
  Top 0.254: R29.2 33.3,16.71 33.34,16.75 33.34,16.7 33.29,16.7 33.24,16.65 33.29,16.6 33.29,16.65 30.69,16.65 v30.34,16.3 | v30.34,9.7 31.42,9.7 U9.7
  Bottom 0.254: v30.34,16.3 v30.34,9.7
PSE_SEL  (via drill 0.4 pad 0.25)
  Top 0.254: 39.29,3 SJ6.2 39.28,3 v40.39,3 | U9.8 30.53,8.89 v30.34,8.7
  Bottom 0.254: v40.39,3 40.44,2.95 40.44,1.55 40.29,1.4 39.09,1.4 38.49,0.8 33.09,0.8 31.12,2.77 31.12,8.7 v30.34,8.7
RAW
  Top 0.254: U2.1 20.33,48.64 20.54,48.85 21.99,48.85 22.24,48.6 U2.3 | 20.22,41.37 20.31,41.37 20.84,41.9 21.24,41.9
  Top 0.305: U2.1 19.85,47.56 19.79,47.5 19.79,41.42 19.84,41.37
  Top 0.61: D2.1 19.84,41.37 20.22,41.37 C19.A
RESET
  Top 0.254: R2.1 11.04,37.1 13.49,34.65 13.49,31.85 13.84,31.5 20.14,31.5 20.49,31.15 20.49,29.37 20.32,29.2 19.24,29.2 19.09,29.05 19.09,24.7 19.29,24.5 19.53,24.5
  Top 0.305: S2.3 9.15,37.28 9.14,37.3 | S2.3 10.93,37.17 R2.1 11.02,37.12 10.99,37.15 | S2.4 S2.3
RFGND  (2 unrouted)
  Top 0.254: U9.61 37.83,11.23 | 37.83,11.23 U9.62 | U9.21 39.53,7.29 | U9.21 U9.22 41.41,5.59 41.52,5.47 R30.2 | U9.24 39.53,7.29 | 39.53,7.29 U9.69 | U9.24 U9.25 41.19,8.05 | C29.2 40.98,16.66 41.14,16.5 41.14,14.58 U9.33 40.25,14.49 40.25,13.49 | 41.25,7.31 U9.24 | U9.21 39.5,5.59 39.49,5.6 | 41.23,13 44.4,13 44.5,12.9 44.5,10.8 45.6,10.8 | 46.9,10.76 JP10.GND@2 46.26,11.4 45,11.4 | 39.29,13.51 39.31,13.49 U9.65 40.25,13.49 | 40.25,11.28 37.88,11.28 37.83,11.23 | 40.25,11.28 41.22,11.28 U9.29 U9.28 U9.27 42.2,9.7 42.3,9.6 42.3,7.5 42.09,7.29 U9.24 | 41.23,13 U9.31 | 40.25,13.49 40.25,13 | 40.25,13 40.25,11.28 | 41.23,13 40.25,13
  pour Top (isolate 1.27): 44.44,17.32 50.04,17.32 50.04,9.52 44.44,9.52
  pour Bottom (isolate 1.016): 44.44,17.32 50.04,17.32 50.04,9.52 44.44,9.52
RST  (via drill 0.4 pad 0.25)
  Top 0.254: TP35.P$1 9.16,11.23 v9.19,11.2 | U11.29 v17.04,7 17.09,7.05
  Bottom 0.254: v9.19,11.2 15.94,11.2 16.28,11.54 R17.1 17,12.64 | v17.04,7 17.09,7.05 17.09,12.55 17,12.64 | 18.19,12.5 C14.1 18.17,12.64 17,12.64
RSTN
  Top 0.254: C28.1 28.56,14.46 R27.1 28.59,14.49 U9.1
RX_B  (via drill 0.4 pad 0.25)
  Top 0.254: v39.93,31.67 39.89,31.75 31.79,31.75 31.06,31.02 31.06,29.85 31.31,29.59 31.31,27.84 31.18,27.78 28.82,27.78 28.7,27.66 28.7,18.69 28.53,18.52 28.01,18.52 27.49,18 v27.49,17.1 | 24.34,18.7 24.34,17.11 v24.18,16.94
  Bottom 0.254: v24.18,16.94 24.34,17.1 v27.49,17.1 | v39.93,31.67 39.93,30.97 40.3,30.6 42.65,30.6 U$1.13
  Bottom 0.305: TP23.TP U$1.13
RX_OP  (via drill 0.4, 0.4 pad 0.25)
  Top 0.254: 20.02,7.79 21.73,7.79 22.09,8.15 v22.09,10.95 | 23.34,19.17 U3.28 | v22.9,17.4 23.3,17.8 23.3,18.64 23.36,18.7
  Top 0.305: U11.30 20.02,7.79 TP19.TP
  Bottom 0.254: v22.9,17.4 21.9,17.4 21.53,17.03 21.53,11.51 v22.09,10.95
RXI  (via drill 0.4 pad 0.25)
  Top 0.254: U3.20 18.98,21.05 18.59,20.65 18.59,18.85 v18.39,18.65 | JP2.5 23.51,12.35 TP15.TP 20.7,13.09 v20.65,13.14
  Bottom 0.254: v18.39,18.65 18.39,17.5 18.4,17.5 18.7,17.2 19.56,17.2 19.94,16.82 19.94,13.21 20.02,13.14 v20.65,13.14
SCK  (via drill 0.4 pad 0.25)
  Top 0.254: TP34.P$1 7.45,8.69 7.64,8.5 v7.64,6 | U11.17 11.49,2.31 11.49,3.55 12.04,4.1 12.04,5.88 v12.06,5.9
  Top 0.305: U11.17 11.5,0.76 11.19,0.45 10.22,0.45 R18.1
  Bottom 0.254: v7.64,6 7.75,5.89 U10.5 12.03,5.89 v12.06,5.9
SCK_BLE  (via drill 0.4 pad 0.25)
  Top 0.254: U4.4 31.31,43.56 | v28.93,44.08 v28.93,44.09 28.89,43.95 TP27.TP 30.59,43.73 30.93,43.73 31.05,43.61 31.31,43.61 | v22.34,34.9 21.86,34.42 21.85,34.42 21.71,34.28 21.71,33.56 21.84,33.43 21.84,25.9 U3.9 21.86,25.89 | 31.18,43.56 31.31,43.56 | 31.31,43.56 31.31,43.61 | 31.31,43.61 31.32,43.61
  Bottom 0.254: v28.93,44.09 26.94,44.1 26.59,43.75 26.59,35.65 25.84,34.9 v22.34,34.9
SCL_BME  (via drill 0.4 pad 0.25)
  Top 0.254: v5.33,27.62 R24.1 5.6,28.32 U8.P$4 | TP18.TP v9.94,24.1 | 19.53,22.03 18.25,22.03 v18.11,22.02
  Bottom 0.254: v18.11,22.02 10.04,22.05 9.94,22.15 v9.94,24.1 5.44,24.1 5.33,24.21 v5.33,27.62
SDA_BME  (via drill 0.4 pad 0.25)
  Top 0.254: 8.44,27.65 8.44,27.7 R23.1 7.37,28.5 v7.34,28.5 7.24,28.6 6.59,28.6 6.25,28.93 U8.P$3 6.25,29.88 6.24,29.9 | v11.09,24.1 TP17.TP 11.09,22.45 11.22,22.32 13.42,22.32 13.62,22.12 13.62,20.32 13.99,19.95 14.56,19.95 v14.61,20 | 19.53,21.54 19.47,21.55 18.64,21.55 18.26,21.17 v18.12,21.17
  Bottom 0.254: v11.09,24.1 11.09,24.5 10.79,24.8 7.54,24.8 7.29,25.05 7.29,27.35 v7.34,28.5 | v14.61,20 14.66,19.95 17.94,19.95 17.94,20.99 v18.12,21.17
SDO/ADR
  Top 0.254: U8.P$5 5.6,35.51 5.84,35.75 11.54,35.75 12.89,34.4 12.89,31.95 12.84,31.9 11.85,31.9 SJ4.2
SWCLK  (via drill 0.4 pad 0.25)
  Top 0.254: U4.36 43.33,44.96 43.49,44.8 v43.49,43.85
  Bottom 0.254: v43.49,43.85 43.19,43.55 41.19,43.55 41.14,43.5 41.14,42.81 TP11.P$1
SWDIO/RST_3V  (via drill 0.4 pad 0.25)
  Top 0.254: U4.35 41.58,44.23 40.12,44.23 39.84,43.95 39.84,40.5 v40.04,40.3
  Bottom 0.254: v40.04,40.3 41.08,40.3 TP12.P$1
TX_B  (via drill 0.4 pad 0.25)
  Top 0.254: v27.49,28.45 30.59,28.45 v30.72,28.42 | U3.12 19.53,24.99 19.53,25 19.53,28.58 19.67,28.72 20.72,28.72 20.93,28.93 20.93,31.97 v20.7,32.2
  Bottom 0.254: 30.71,28.33 v30.72,28.42 31.67,29.38 U$1.14 42.84,29.2 44.4,29.2 44.8,28.8 45.6,28.8 46.27,28.13 TP24.TP | v20.7,32.2 20.88,32.02 20.88,29.7 20.97,29.6 25.39,29.6 26.5,28.5 27.44,28.5 v27.49,28.45
TX_GPS  (via drill 0.4 pad 0.25)
  Top 0.254: U3.21 20.73,20.55 v20.94,20.25 | U9.44 32.3,15.42 TP16.TP 29.36,16.2 29.36,17.44 29.15,17.65 v28.14,17.65
  Bottom 0.254: v28.14,17.65 28.09,17.65 28.05,17.69 25.4,17.69 23.68,19.4 21.2,19.4 21,19.6 21,20.18 v20.94,20.25
TX_OP  (via drill 0.4)
  Top 0.254: 20.24,8.5 20.17,8.57 TP21.TP 20.34,8.8 19.95,8.8 19.89,8.86 19.89,13.59 20.1,13.8 v22.2,13.8 | v22.4,16.7 23.4,16.7 23.5,16.8 23.5,17.3 23.9,17.7 23.9,18.65 23.85,18.7
  Top 0.305: U11.31 20.13,8.59 TP21.TP
  Bottom 0.254: v22.2,13.8 22.2,16.5 v22.4,16.7
TXLED
  Top 0.254: R6.1 19,17.45 | 19,17.45 19,17.43 TP6.TP 19.07,17.56 | U3.22 19.14,20.06 19.07,20 19.07,17.52 19,17.45
USER  (via drill 0.4, 0.4 pad 0.25)
  Top 0.254: S3.4 24.38,36.19 v24.35,36 | v20.6,16.9 20.8,16.9 22.37,18.47 22.37,18.7
  Top 0.305: TP30.TP 24.34,38.83 S3.3 S3.4
  Bottom 0.254: 24.33,36.01 v24.35,36 24.11,36.14 19.68,36.14 19.43,35.89 19.04,35.5 19.04,29.8 18.69,29.45 18.69,22.75 18.94,22.5 19.05,22.39 19.05,17.85 19.2,17.7 19.8,17.7 v20.6,16.9
UVCC  (via drill 0.4 pad 0.25, 0.4 pad 0.3)
  Top 0.254: 17.09,47.5 17.09,47.95 16.99,48.05 | 18.34,47.45 18.34,47.4 | 22.89,25.89 U3.7 22.89,25.84 22.89,25.15 23.04,25 25.14,25 25.33,25.19 U3.2 | 22.86,26.34 22.86,33.27 23.04,33.44 23.04,37.45 v22.84,37.65 | v7.2,47.51 7.2,48.11 6.56,48.75 R21.2
  Top 0.305: v16.94,47.5 17.09,47.5 | F1.1 18.37,47.48 18.34,47.45 | C6.2 5.83,45.51 5.19,46.15 5.19,48.45 5.49,48.75 R21.2
  Top 0.406: 15.06,48.38 15.06,48.62 15.09,48.65 15.09,48.4 15.44,48.05 16.99,48.05 17.91,48.05 F1.1
  Bottom 0.254: v16.94,47.5 17.94,47.5 18.29,47.15 18.29,40.45 18.39,40.35 22.69,40.35 22.84,40.2 v22.84,37.65
  Bottom 0.305: v7.2,47.51 v16.94,47.5
UVCC_BATT  (via drill 0.4 pad 0.3)
  Top 0.254: R15.1 8.36,46.72 8.59,46.95 10.79,46.95 10.94,46.8 10.94,44.82 | 10.94,44.82 10.94,44 v11.02,43.92 | 11.83,44.85 C9.1 10.96,44.84 10.94,44.82
  Top 0.305: R15.1 8,45.8 7.59,45.8 | 7.59,45.8 7.59,44.47 TP8.TP | U1.4 v11.2,42.04 v11.19,42.05 | 6.14,47.05 R21.1 6.34,47.05 7.59,45.8
  Bottom 0.305: v11.19,42.05 11.19,43.8 v11.02,43.92
VBAT  (via drill 0.4 pad 0.25)
  Top 0.254: R31.2 35.79,2.37 | 35.79,2.37 36.37,2.37 C31.1 36.24,2.5 | U9.18 37.13,4.86 v37.14,4.6 36.94,4.8 32.99,4.8 32.89,4.7 v32.89,4.48 | v37.14,1.48 37.14,1.6 35.88,1.6 35.81,1.67 35.81,2.35 35.79,2.37 | C30.+ v32.69,17.7
  Bottom 0.254: v37.14,4.6 v37.14,1.48 | v32.69,17.7 32.69,8.8 32.89,8.6 v32.89,4.48
VBATT  (via drill 0.4 pad 0.25)
  Top 0.254: 8.18,40.6 8.18,40.25 8.66,39.77 15.26,39.77 15.26,40.39 R20.2 14.1,41.59 v14.1,42.36
  Top 0.305: TP7.TP 8.39,40.99 U1.3 | C8.1 8.18,40.6 | 8.18,40.6 TP7.TP | TP7.TP 8.39,40.55 8.34,40.6 8.18,40.6 | 15.09,40.6 R20.2
  Bottom 0.254: 14.04,43.23 14.04,42.42 v14.1,42.36
  Bottom 0.305: 14.04,43.23 13.94,43.33
  Bottom 0.813: TP1.TP 13.13,43.31 13.19,43.25 13.27,43.33 13.94,43.33 J1.2
VCC  (via drill 0.4, 0.4 pad 0.25)  (1 unrouted)
  Top 0.254: C25.1 12.49,25.1 12.19,24.8 9.24,24.8 8.99,24.55 8.99,23.45 8.64,23.1 7.24,23.1 7.14,23.2 SJ2.2 | C12.2 19.14,0.75 | SJ6.1 39.07,2.39 C26.1 37.75,2.39 37.94,2.2 | SJ7.1 31.85,2.04 33.09,0.8 38.49,0.8 39.09,1.4 39.09,2.1 SJ6.1 | C29.1 38.73,16.13 U9.36 38.69,15.35 38.74,15.35 38.74,14.27 32.68,14.27 32.68,13.69 | C29.1 39.26,16.72 39.29,16.75 | LED5.A 39.24,16.68 C29.1 | v12.44,38.85 11.07,38.85 R2.2 | U4.3 31.18,44.26 31.14,44.3 v31.14,44.95 30.44,45.65 29.39,45.65 | 33.29,36.27 U4.14 v33.2,34.94 | 39.31,2.15 SJ6.1 | 19.16,0.85 C12.2 | 39.26,2.2 SJ6.1 | U3.24 21.34,19.24 21.34,19.74 21.6,20 25.7,20 | SJ6.1 | R27.2 27.26,14.43 27.34,14.35 27.34,14.15 | R27.2 27.11,14.43 | C29.1 39.26,17.22 39.44,17.4 42.45,17.4 42.54,17.31 | 14.66,11 14.7,10.96 U11.4 14.7,9.7 14.5,9.5 13.2,9.5 13.04,9.66 13.04,10.82 | C12.2 v20.52,0.83 20.65,0.8 | 32.68,13.69 U9.2 28.76,13.69 v28.28,13.21 | 32.68,13.69 32.68,8.37 36.33,8.37 U9.58 | 28.49,11.56 C27.A 28.28,12.13 v28.28,13.21 | 14.14,29 18.49,29 18.5,28.99 | 18.5,28.99 18.5,24.33 18.79,24.04 18.8,24.04 18.83,24.01 19.52,24.01 19.53,24.01 | 18.5,28.99 18.5,30.14 v18.34,30.3 | 27.16,14.5 R27.2 | U3.14 25.71,24.01 | 25.71,24.01 25.71,24.02 25.88,24.19 25.88,24.85 26.02,24.99 U3.44 | 25.71,24.01 25.71,20.01 25.7,20 | 42.54,17.31 42.54,15.61 L1.1 | 42.54,17.31 42.54,32.41 41.88,33.07 33.37,33.07 33.22,33.22 33.22,35.08 v33.2,34.94 | 25.7,20 26.63,20 U3.34 | v25.9,38.1 26,38 26,36.9 28,34.9 33.2,34.9 v33.2,34.94 | v28.28,13.21 27.39,13.21 27.2,13.4 27.2,14.4 R27.2 | 7.5,32.6 9.8,32.6 9.85,32.65 R26.2 9.85,31.8 C24.1 9.64,31.8 9.64,31.94 9.8,32.1 | 7.5,32.6 7.5,32.08 U8.P$8 7.55,32.55 7.5,32.6
  Top 0.254: 7.5,32.6 6.3,32.6 6.3,32.07 U8.P$6 | 7.5,32.6 7.5,33.4 v7.6,33.5
  Top 0.305: 27.99,45.15 27.88,45.04 R22.2 27.83,43.84 27.79,43.8 27.94,43.8 28.14,43.6 | R2.2 11.04,38.8 | U2.5 20.33,50.24 20.34,50.25 20.34,50.5 20.29,50.55 | 13.04,10.82 U11.6 | 13.9,2.95 U11.20 13.9,1.39 14.59,0.7 19.01,0.7 C12.2 | 13.9,2.95 13.9,3.35 13.8,3.45 12.54,3.45 12.3,3.21 U11.18 | 13.9,9.34 13.9,6.75 13.89,6.74 13.89,2.96 13.9,2.95 | S1.3 18.38,36.76 v18.34,36.8 | S1.6 19.56,30.3 v18.34,30.3 18.44,30.2 | 19.64,36.8 v18.34,36.8 | v18.34,36.8 18.29,36.85 | C10.1 25.96,42.06 | C3.2 25.98,43.01 v25.94,43.05 | C25.1 13.38,25.94 13.44,26 13.44,28.3 14.14,29 | 20.65,0.8 24.8,0.8 26,2 26,3 | 26,3 26,11 27,12 28.41,12 C27.A | SJ7.1 30.6,2.4 30,3 26,3
  Top 0.406: U2.5 20.33,51.09 20.54,51.3 24.79,51.3 24.94,51.15 24.94,49.4 C13.A 28.14,49.34 R11.2 28.28,49.2 28.94,49.2 29.39,48.75 29.39,45.65 28.89,45.15 27.99,45.15 26.79,45.15 25.96,44.32 C10.1
  Top 0.61: 25.96,42.06 C3.2 | 19.64,36.8 S1.3
  Bottom 0.254: C7.1 35.42,36.94 R19.1 35.38,37.77 35.05,38.1 30.24,38.1 29.69,38.65 29.69,44.75 29.89,44.95 v31.14,44.95 | C7.1 | C7.1 36.68,36.91 36.74,36.85 36.74,35.83 TP13.TP 36.7,35.67 36.7,35.09 36.61,35 33.34,35 v33.2,34.94 33.04,34.9 29.84,34.9 27.99,33.05 27.99,30.05 28.66,29.38 U$1.11 | 9.59,35.91 9.59,38.2 10.24,38.85 v12.44,38.85 | v20.52,0.83 C12.2 18.84,1.13 18.84,11.32 19.08,11.56 19.08,15.6 18.91,15.77 17.16,15.77 16.28,14.89 R17.2 | SJ5.1 28.28,11.2 v28.28,13.21 | SJ3.2 9.61,34.57 9.59,34.4 9.59,35.91 | 9.59,35.91 9.5,36 7.9,36 7.6,35.7 v7.6,33.5
  Bottom 0.305: v18.34,36.8 v18.34,30.3 | v12.44,38.85 18.24,38.85 18.34,38.75 v18.34,36.8 | v18.34,36.8 18.39,36.75 25.74,36.75 25.94,36.95 v25.94,43.05
VCC1
  Top 0.305: R22.1 27.88,38.93 S3.2 S3.1
(copper drawn outside any net)
  shapes: Top area x2508